# Altium schematic sheet MOTORDEMO.SchDoc
size A3
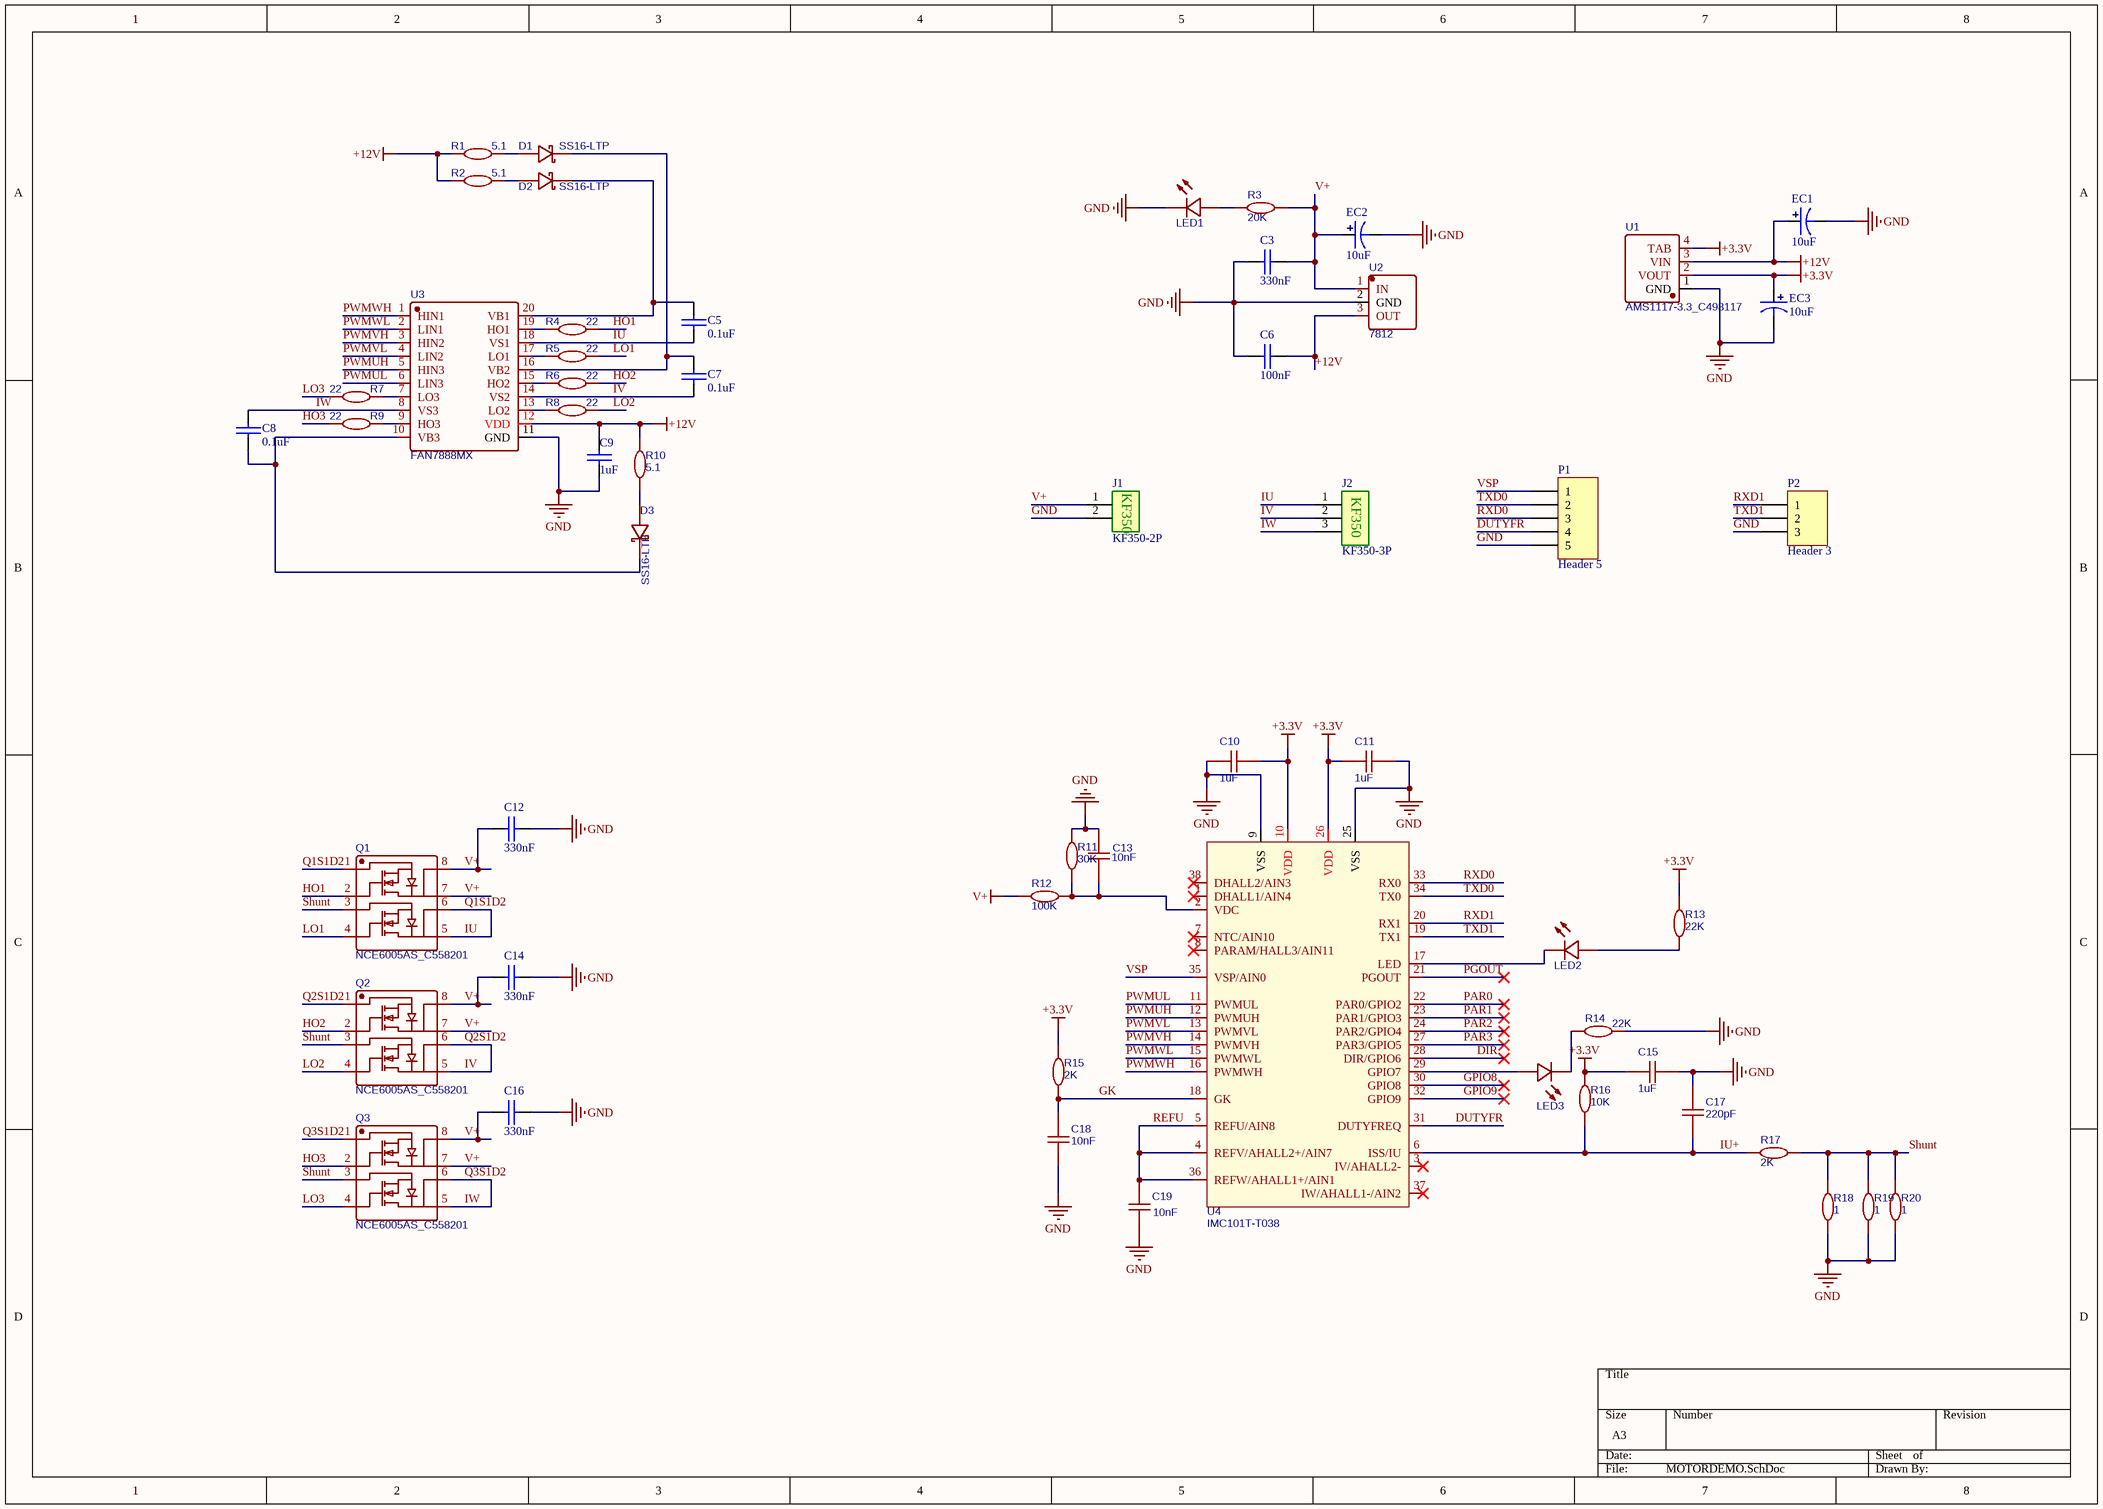
[diagram p0: MOTORDEMO.SchDoc]

## Parts
C3  330nF  [C 0603_L]
C5  0.1uF  [C 0603_L]
C6  100nF  [C 0603_L]
C7  0.1uF  [C 0603_L]
C8  0.1uF  [C 0603_L]
C9  1uF  [C 0603_L]
C10  1uF  [C0603]
C11  1uF  [C0603]
C12  330nF  [C 0603_L]
C13  10nF  [C0603]
C14  330nF  [C 0603_L]
C15  1uF  [C0603]
C16  330nF  [C 0603_L]
C17  220pF  [C0603]
C18  10nF  [C0603]
C19  10nF  [C0603]
D1  SS16-LTP  [LL-34_L3.5-W1.5-RD]
D2  SS16-LTP  [LL-34_L3.5-W1.5-RD]
D3  SS16-LTP  [LL-34_L3.5-W1.5-RD]
EC1  10uF  [SMD-EC5.0X5.3X5.4]
EC2  10uF  [SMD-EC5.0X5.3X5.4]
EC3  10uF  [SMD-EC5.0X5.3X5.4]
J1  KF350-2P  [KF350-2P]
J2  KF350-3P  [KF350-3P]
LED1  LED  [LED0603-R-RD]  (value not drawn)
LED2  LED  [LED0603-R-RD]  (value not drawn)
LED3  LED  [LED0603-R-RD]  (value not drawn)
P1  Header 5  [HDR1X5]
P2  Header 3  [HDR1X3]
Q1  NCE6005AS_C558201  [NCE6005AS]
Q2  NCE6005AS_C558201  [NCE6005AS]
Q3  NCE6005AS_C558201  [NCE6005AS]
R1  5.1  [R0603]
R2  5.1  [R0603]
R3  20K  [R0603]
R4  22  [R0603]
R5  22  [R0603]
R6  22  [R0603]
R7  22  [R0603]
R8  22  [R0603]
R9  22  [R0603]
R10  5.1  [R0603]
R11  30K  [R0603]
R12  100K  [R0603]
R13  22K  [R0603]
R14  22K  [R0603]
R15  2K  [R0603]
R16  10K  [R0603]
R17  2K  [R0603]
R18  1  [R1206]
R19  1  [R1206]
R20  1  [R1206]
U1  AMS1117-3.3_C498117  [PG-SOT223-4_L6.5-W3.5-P2.30-LS7.0-BR]
U2  7812  [TO-220-3_L10.0-W4.5-P2.54-L]
U3  FAN7888MX  [FAN7888]
U4  IMC101T-T038  [IMC101T-T038]

## Nets
+3.3V: C10.1 C11.2 C15.1 EC3.1 R13.2 R15.1 R16.1 U1.2(VOUT) U1.4(TAB) U4.10(VDD) U4.26(VDD)
+12V: C6.1 C9.2 EC1.1 R1.2 R2.2 R10.1 U1.3(VIN) U2.3(OUT) U3.12(VDD)
GND: C3.2 C6.2 C9.1 C10.2 C11.1 C12.1 C13.2 C14.1 C15.2 C16.1 C17.2 C18.1 C19.1 EC1.2 EC2.2 EC3.2 J1.2 LED1.2 P1.5 P2.3 R11.1 R14.1 R18.1 R19.1 R20.1 U1.1(GND) U2.2(GND) U3.11(GND) U4.9(VSS) U4.25(VSS)
V+: C3.1 C12.2 C14.2 C16.2 EC2.1 J1.1 Q1.7 Q1.8 Q2.7 Q2.8 Q3.7 Q3.8 R3.1 R12.2 U2.1(IN)
DIR: U4.28(DIR/GPIO6)
DUTYFR: P1.4 U4.31(DUTYFREQ)
GK: C18.2 R15.2 U4.18(GK)
GPIO8: U4.30(GPIO8)
GPIO9: U4.32(GPIO9)
HO1: Q1.2 R4.1
HO2: Q2.2 R6.1
HO3: Q3.2 R9.2
IU: C5.1 J2.1 Q1.1 Q1.5 Q1.6 U3.18(VS1)  [also labelled Q1S1D2]
IU+: C17.1 R16.2 R17.1 U4.6(ISS/IU)
IV: C7.1 J2.2 Q2.1 Q2.5 Q2.6 U3.14(VS2)  [also labelled Q2S1D2]
IW: C8.2 J2.3 Q3.1 Q3.5 Q3.6 U3.8(VS3)  [also labelled Q3S1D2]
LO1: Q1.4 R5.1
LO2: Q2.4 R8.1
LO3: Q3.4 R7.2
PAR0: U4.22(PAR0/GPIO2)
PAR1: U4.23(PAR1/GPIO3)
PAR2: U4.24(PAR2/GPIO4)
PAR3: U4.27(PAR3/GPIO5)
PGOUT: U4.21(PGOUT)
PWMUH: U3.5(HIN3) U4.12(PWMUH)
PWMUL: U3.6(LIN3) U4.11(PWMUL)
PWMVH: U3.3(HIN2) U4.14(PWMVH)
PWMVL: U3.4(LIN2) U4.13(PWMVL)
PWMWH: U3.1(HIN1) U4.16(PWMWH)
PWMWL: U3.2(LIN1) U4.15(PWMWL)
REFU: C19.2 U4.4(REFV/AHALL2+/AIN7) U4.5(REFU/AIN8) U4.36(REFW/AHALL1+/AIN1)
RXD0: P1.3 U4.33(RX0)
RXD1: P2.1 U4.20(RX1)
Shunt: Q1.3 Q2.3 Q3.3 R17.2 R18.2 R19.2 R20.2
TXD0: P1.2 U4.34(TX0)
TXD1: P2.2 U4.19(TX1)
VSP: P1.1 U4.35(VSP/AIN0)
NetC5_2: C5.2 D2.1(C) U3.20(VB1)
NetC7_2: C7.2 D1.1(C) U3.16(VB2)
NetC8_1: C8.1 D3.1(C) U3.10(VB3)
NetC13_1: C13.1 R11.2 R12.1 U4.2(VDC)
NetD1_2: D1.2(A) R1.1
NetD2_2: D2.2(A) R2.1
NetD3_2: D3.2(A) R10.2
NetLED1_1: LED1.1 R3.2
NetLED2_1: LED2.1 R13.1
NetLED2_2: LED2.2 U4.17(LED)
NetLED3_1: LED3.1 U4.29(GPIO7)
NetLED3_2: LED3.2 R14.2
NetR4_2: R4.2 U3.19(HO1)
NetR5_2: R5.2 U3.17(LO1)
NetR6_2: R6.2 U3.15(HO2)
NetR7_1: R7.1 U3.7(LO3)
NetR8_2: R8.2 U3.13(LO2)
NetR9_1: R9.1 U3.9(HO3)

Not connected (* = marked no-connect by the designer): U4 1(DHALL1/AIN4)* 3(IV/AHALL2-)* 7(NTC/AIN10)* 8(PARAM/HALL3/AIN11)* 37(IW/AHALL1-/AIN2)* 38(DHALL2/AIN3)*

## Notes on the sheet
- (in symbol KF350-2P) KF350
- (in symbol KF350-3P) KF350

## Library data of the parts
C3 C5-C9 C12 C14 C16 = CAP: Capacitor
C10 C11 C13 C15 C17-C19 = 100nF: BOM_Manufacturer: SAMSUNG; BOM_Manufacturer Part: CL10B104KC8NNNC; nameAlias: Capacitance; BOM_Supplier: LCSC; BOM_Supplier Part: C15725; BOM_JLCPCB Part Class: Extended Part; spicePre: C; spiceSymbolName: CL10B104KC8NNNC
D1-D3 = SS16-LTP: BOM_Manufacturer: MCC; BOM_Supplier: LCSC; BOM_Manufacturer Part: SS16-LTP; BOM_Supplier Part: C85689; BOM_JLCPCB Part Class: Extended Part; spicePre: D; spiceSymbolName: SS16-LTP
EC1-EC3 = SMD_ECAP: 贴片电解电容
LED1-LED3 = LED: BOM_Manufacturer: Everlight Elec; BOM_Manufacturer Part: 19-213/R6W-BP2Q2B/3T; Contributor: LCSC; BOM_Supplier: LCSC; BOM_Supplier Part: C181863; BOM_JLCPCB Part Class: Extended Part; spicePre: L; spiceSymbolName: 19-213/R6W-BP2Q2B/3T
P1 = Header 5: Header, 5-Pin; LatestRevisionDate: 17-Jul-2002; LatestRevisionNote: Re-released for DXP Platform.; Publisher: Altium Limited
P2 = Header 3: Header, 3-Pin; LatestRevisionDate: 17-Jul-2002; LatestRevisionNote: Re-released for DXP Platform.; Publisher: Altium Limited
Q1-Q3 = NCE6005AS_C558201: BOM_Manufacturer: VBsemi Elec; Contributor: LCSC; BOM_Supplier: LCSC; BOM_Supplier Part: C558201; BOM_Manufacturer Part: NCE6005AS; BOM_JLCPCB Part Class: Extended Part; spicePre: Q; spiceSymbolName: NCE6005AS_C558201
R1-R20 = 1M: BOM_Manufacturer: Huaxin S&T; BOM_Manufacturer Part: MR06X105JTL; nameAlias: Resistance (Ohms); Contributor: LCSC; BOM_Supplier: LCSC; BOM_Supplier Part: C327832; spicePre: R; spiceSymbolName: MR06X105JTL
U1 = AMS1117-3.3_C498117: BOM_Manufacturer: HGC(Huaguan Semicon); Contributor: LCSC; BOM_Supplier: LCSC; BOM_Supplier Part: C498117; BOM_Manufacturer Part: AMS1117-3.3; spicePre: U; spiceSymbolName: AMS1117-3.3_C498117
U2 = 7812: BOM_Manufacturer: Foshan Blue Rocket Elec; Contributor: LCSC; BOM_Supplier: LCSC; BOM_Supplier Part: C358369; BOM_Manufacturer Part: 7812; BOM_JLCPCB Part Class: Extended Part; spicePre: U; spiceSymbolName: 7812
U3 = FAN7888MX: BOM_Manufacturer: ON Semicon; Contributor: LCSC; BOM_Supplier: LCSC; BOM_Supplier Part: C258167; BOM_Manufacturer Part: FAN7888MX; BOM_JLCPCB Part Class: Extended Part; spicePre: U; spiceSymbolName: FAN7888MX
U4 = IMC101T-T038: BOM_Manufacturer: Infineon Technologies; Contributor: LCSC; BOM_Supplier: LCSC; BOM_Supplier Part: C536267; BOM_Manufacturer Part: IMC101T-T038; BOM_JLCPCB Part Class: Extended Part; spicePre: U; spiceSymbolName: IMC101T-T038